# Altium project LimeSDR_1v2s.PrjPcb (part 4 of 4)
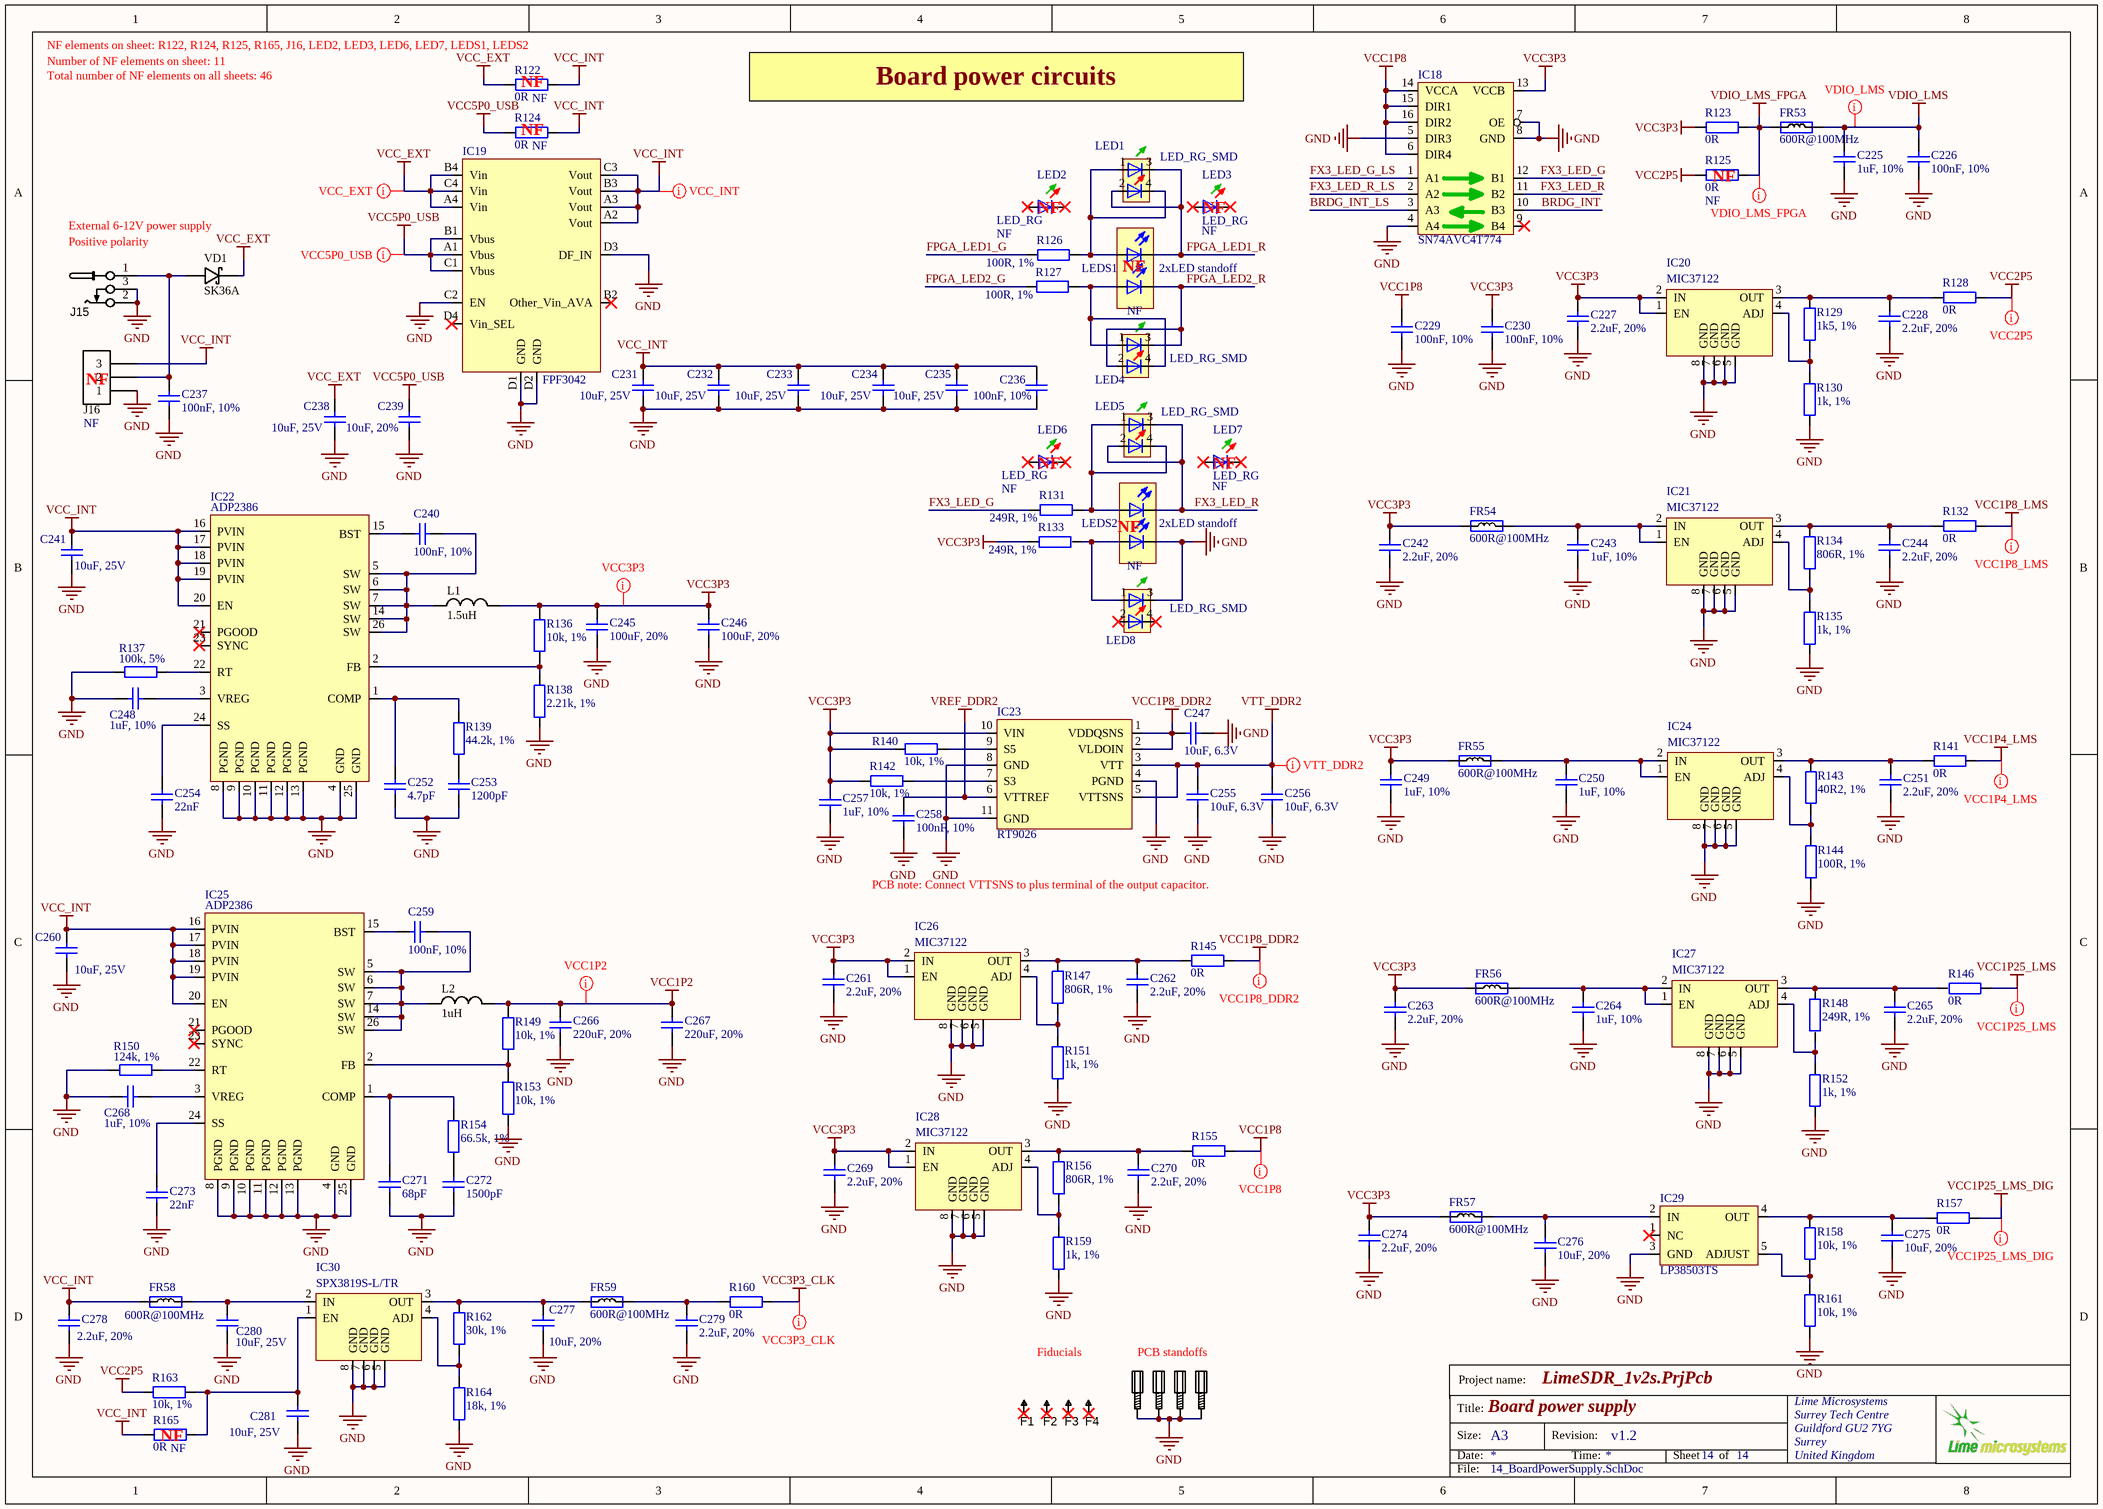
[diagram p10: 14_BoardPowerSupply.SchDoc]

## Nets that join several sheets
GND: 04_LMS7002M_Digital (13 pins), 06_LMS7002M_Power (84 pins), 07_FPGA_banks_1_2_3_4 (15 pins), 08_FPGA_banks_5_6_7_8 (19 pins), 09_FPGA_misc (197 pins), 11_USB3_0_device (44 pins), 14_BoardPowerSupply (132 pins)
VCC1P2: 09_FPGA_misc (62 pins), 14_BoardPowerSupply (C266.2 C267.2 L2.2 R149.1)
VCC1P4_LMS: 06_LMS7002M_Power (6 pins), 14_BoardPowerSupply (R141.1)
VCC1P8: 07_FPGA_banks_1_2_3_4 (R166.2), 09_FPGA_misc (42 pins), 14_BoardPowerSupply (6 pins)
VCC1P8_LMS: 06_LMS7002M_Power (11 pins), 14_BoardPowerSupply (R132.1)
VCC1P25_LMS: 06_LMS7002M_Power (22 pins), 14_BoardPowerSupply (R146.1)
VCC1P25_LMS_DIG: 06_LMS7002M_Power (R16.2 R18.2 R20.2 R22.2), 14_BoardPowerSupply (R157.1)
VCC2P5: 09_FPGA_misc (FR61.1), 14_BoardPowerSupply (R125.2 R128.1 R163.1)
VCC3P3: 09_FPGA_misc (25 pins), 11_USB3_0_device (25 pins), 14_BoardPowerSupply (29 pins)
VCC5P0_USB: 11_USB3_0_device (C132.1 FR36.1 J11.1), 14_BoardPowerSupply (5 pins)
VCC_INT: 09_FPGA_misc (R173.1), 14_BoardPowerSupply (28 pins)
VDIO_LMS: 04_LMS7002M_Digital (14 pins), 06_LMS7002M_Power (5 pins), 14_BoardPowerSupply (C225.2 C226.1 FR53.2)
VDIO_LMS_FPGA: 09_FPGA_misc (33 pins), 11_USB3_0_device (R64.1), 14_BoardPowerSupply (FR53.1 R123.1 R125.1)
VREF_DDR2: 07_FPGA_banks_1_2_3_4 (24 pins), 14_BoardPowerSupply (C258.1 IC23.6)
BRDG_INT: 11_USB3_0_device (IC12.9 R90.1), 14_BoardPowerSupply (IC18.10)
BRDG_INT_LS: 11_USB3_0_device (IC6.F2), 14_BoardPowerSupply (IC18.3)
BRDG_SPI_FPGA_SS: 07_FPGA_banks_1_2_3_4 (IC31.K7), 11_USB3_0_device (IC12.1)
BRDG_SPI_MISO: 07_FPGA_banks_1_2_3_4 (IC31.C1), 09_FPGA_misc (IC32.5), 11_USB3_0_device (IC12.5)
BRDG_SPI_MOSI: 07_FPGA_banks_1_2_3_4 (IC31.B1), 09_FPGA_misc (IC32.2), 11_USB3_0_device (IC12.6)
BRDG_SPI_SCLK: 07_FPGA_banks_1_2_3_4 (IC31.B2), 09_FPGA_misc (IC32.11), 11_USB3_0_device (IC12.11)
EXP_AS_SS: 09_FPGA_misc (IC32.14 R184.2), 11_USB3_0_device (IC10.2)
EXP_AS_SW: 09_FPGA_misc (R181.2), 11_USB3_0_device (IC10.10)
FAN_CTRL: 07_FPGA_banks_1_2_3_4 (IC31.E4), 09_FPGA_misc (R182.2 R185.1 VT1.G)
FPGA_AS_ASDO: 07_FPGA_banks_1_2_3_4 (IC31.D1), 09_FPGA_misc (IC32.3)
FPGA_AS_DATA0: 07_FPGA_banks_1_2_3_4 (IC31.K1), 09_FPGA_misc (R186.2)
FPGA_AS_NCSO: 07_FPGA_banks_1_2_3_4 (IC31.E2), 09_FPGA_misc (IC32.13)
FPGA_CONF_DONE: 09_FPGA_misc (IC31.M18), 11_USB3_0_device (R64.2 R69.2)
FPGA_GPIO0: 07_FPGA_banks_1_2_3_4 (IC31.H8), 09_FPGA_misc (J18.3)
FPGA_GPIO1: 07_FPGA_banks_1_2_3_4 (IC31.H6), 09_FPGA_misc (J18.4)
FPGA_GPIO2: 07_FPGA_banks_1_2_3_4 (IC31.H2), 09_FPGA_misc (J18.5)
FPGA_GPIO3: 07_FPGA_banks_1_2_3_4 (IC31.H1), 09_FPGA_misc (J18.6)
FPGA_GPIO4: 07_FPGA_banks_1_2_3_4 (IC31.G4), 09_FPGA_misc (J18.7)
FPGA_GPIO5: 07_FPGA_banks_1_2_3_4 (IC31.G3), 09_FPGA_misc (J18.8)
FPGA_GPIO6: 07_FPGA_banks_1_2_3_4 (IC31.F2), 09_FPGA_misc (J18.9)
FPGA_GPIO7: 07_FPGA_banks_1_2_3_4 (IC31.F1), 09_FPGA_misc (J18.10)
FPGA_I2C_SCL: 07_FPGA_banks_1_2_3_4 (IC31.H7), 11_USB3_0_device (R72.2)
FPGA_I2C_SDA: 07_FPGA_banks_1_2_3_4 (IC31.J7), 11_USB3_0_device (R70.2)
FPGA_LED1_G: 07_FPGA_banks_1_2_3_4 (IC31.D2), 14_BoardPowerSupply (R126.1)
FPGA_LED1_R: 07_FPGA_banks_1_2_3_4 (IC31.E3), 14_BoardPowerSupply (LED1.2 LED1.3 LEDS1.K1)
FPGA_LED2_G: 07_FPGA_banks_1_2_3_4 (IC31.J4), 14_BoardPowerSupply (R127.1)
FPGA_LED2_R: 07_FPGA_banks_1_2_3_4 (IC31.E1), 14_BoardPowerSupply (LED4.2 LED4.3 LEDS1.K2)
FPGA_NCONFIG: 09_FPGA_misc (IC31.K5), 11_USB3_0_device (R66.2 R67.2)
FPGA_NSTATUS: 09_FPGA_misc (IC31.K6), 11_USB3_0_device (R65.2 R68.2)
FPGA_SPI0_LMS_SS: 04_LMS7002M_Digital (R10.2), 08_FPGA_banks_5_6_7_8 (IC31.D10)
FPGA_SPI0_MISO: 04_LMS7002M_Digital (R13.2), 08_FPGA_banks_5_6_7_8 (IC31.C8)
FPGA_SPI0_MOSI: 04_LMS7002M_Digital (R12.2), 08_FPGA_banks_5_6_7_8 (IC31.D7)
FPGA_SPI0_SCLK: 04_LMS7002M_Digital (R11.2), 08_FPGA_banks_5_6_7_8 (IC31.E6)
FPGA_UART_RX: 07_FPGA_banks_1_2_3_4 (IC31.J1), 11_USB3_0_device (R71.2)
FPGA_UART_TX: 07_FPGA_banks_1_2_3_4 (IC31.J8), 11_USB3_0_device (R73.2)
FX3_CTL0: 07_FPGA_banks_1_2_3_4 (IC31.L6), 11_USB3_0_device (R60.2)
FX3_CTL1: 07_FPGA_banks_1_2_3_4 (IC31.L7), 11_USB3_0_device (R61.2)
FX3_CTL2: 07_FPGA_banks_1_2_3_4 (IC31.M1), 11_USB3_0_device (R61.4)
FX3_CTL3: 07_FPGA_banks_1_2_3_4 (IC31.M2), 11_USB3_0_device (R61.6)
FX3_CTL4: 07_FPGA_banks_1_2_3_4 (IC31.M3), 11_USB3_0_device (R61.8)
FX3_CTL5: 07_FPGA_banks_1_2_3_4 (IC31.M4), 11_USB3_0_device (R62.2)
FX3_CTL6: 07_FPGA_banks_1_2_3_4 (IC31.M6), 11_USB3_0_device (R62.4)
FX3_CTL7: 07_FPGA_banks_1_2_3_4 (IC31.M7), 11_USB3_0_device (R62.6)
FX3_CTL8: 07_FPGA_banks_1_2_3_4 (IC31.M8), 11_USB3_0_device (R62.8)
FX3_CTL9: 07_FPGA_banks_1_2_3_4 (IC31.N1), 11_USB3_0_device (R63.2)
FX3_CTL10: 07_FPGA_banks_1_2_3_4 (IC31.N2), 11_USB3_0_device (R63.4)
FX3_CTL11: 07_FPGA_banks_1_2_3_4 (IC31.N5), 11_USB3_0_device (R63.6)
FX3_CTL12: 07_FPGA_banks_1_2_3_4 (IC31.N6), 11_USB3_0_device (R63.8)
FX3_DQ0: 08_FPGA_banks_5_6_7_8 (IC31.M19), 11_USB3_0_device (R48.2)
FX3_DQ1: 08_FPGA_banks_5_6_7_8 (IC31.AA21), 11_USB3_0_device (R48.4)
FX3_DQ2: 08_FPGA_banks_5_6_7_8 (IC31.Y22), 11_USB3_0_device (R48.6)
FX3_DQ3: 08_FPGA_banks_5_6_7_8 (IC31.Y21), 11_USB3_0_device (R48.8)
FX3_DQ4: 08_FPGA_banks_5_6_7_8 (IC31.W22), 11_USB3_0_device (R50.2)
FX3_DQ5: 08_FPGA_banks_5_6_7_8 (IC31.W21), 11_USB3_0_device (R50.4)
FX3_DQ6: 08_FPGA_banks_5_6_7_8 (IC31.W20), 11_USB3_0_device (R50.6)
FX3_DQ7: 08_FPGA_banks_5_6_7_8 (IC31.V22), 11_USB3_0_device (R50.8)
FX3_DQ8: 08_FPGA_banks_5_6_7_8 (IC31.V21), 11_USB3_0_device (R52.2)
FX3_DQ9: 08_FPGA_banks_5_6_7_8 (IC31.U22), 11_USB3_0_device (R52.4)
FX3_DQ10: 08_FPGA_banks_5_6_7_8 (IC31.U21), 11_USB3_0_device (R52.6)
FX3_DQ11: 08_FPGA_banks_5_6_7_8 (IC31.U20), 11_USB3_0_device (R52.8)
FX3_DQ12: 08_FPGA_banks_5_6_7_8 (IC31.U19), 11_USB3_0_device (R57.2)
FX3_DQ13: 08_FPGA_banks_5_6_7_8 (IC31.M22), 11_USB3_0_device (R57.4)
FX3_DQ14: 08_FPGA_banks_5_6_7_8 (IC31.M21), 11_USB3_0_device (R57.6)
FX3_DQ15: 08_FPGA_banks_5_6_7_8 (IC31.R22), 11_USB3_0_device (R57.8)
FX3_DQ16: 08_FPGA_banks_5_6_7_8 (IC31.R21), 11_USB3_0_device (R49.1)
FX3_DQ17: 08_FPGA_banks_5_6_7_8 (IC31.R20), 11_USB3_0_device (R49.3)
FX3_DQ18: 08_FPGA_banks_5_6_7_8 (IC31.R19), 11_USB3_0_device (R49.5)
FX3_DQ19: 08_FPGA_banks_5_6_7_8 (IC31.R18), 11_USB3_0_device (R49.7)
FX3_DQ20: 08_FPGA_banks_5_6_7_8 (IC31.P22), 11_USB3_0_device (R51.1)
FX3_DQ21: 08_FPGA_banks_5_6_7_8 (IC31.P21), 11_USB3_0_device (R51.3)
FX3_DQ22: 08_FPGA_banks_5_6_7_8 (IC31.M20), 11_USB3_0_device (R51.5)
FX3_DQ23: 08_FPGA_banks_5_6_7_8 (IC31.P16), 11_USB3_0_device (R51.7)
FX3_DQ24: 08_FPGA_banks_5_6_7_8 (IC31.P15), 11_USB3_0_device (R55.1)
FX3_DQ25: 08_FPGA_banks_5_6_7_8 (IC31.N22), 11_USB3_0_device (R55.3)
FX3_DQ26: 08_FPGA_banks_5_6_7_8 (IC31.N21), 11_USB3_0_device (R55.5)
FX3_DQ27: 08_FPGA_banks_5_6_7_8 (IC31.N20), 11_USB3_0_device (R55.7)
FX3_DQ28: 08_FPGA_banks_5_6_7_8 (IC31.N19), 11_USB3_0_device (R58.1)
FX3_DQ29: 08_FPGA_banks_5_6_7_8 (IC31.N18), 11_USB3_0_device (R58.3)
FX3_DQ30: 08_FPGA_banks_5_6_7_8 (IC31.N17), 11_USB3_0_device (R58.5)
FX3_DQ31: 08_FPGA_banks_5_6_7_8 (IC31.N16), 11_USB3_0_device (R58.7)
FX3_LED_G_LS: 11_USB3_0_device (IC6.H6), 14_BoardPowerSupply (IC18.1)
FX3_LED_R_LS: 11_USB3_0_device (IC6.K5), 14_BoardPowerSupply (IC18.2)
FX3_PCLK: 08_FPGA_banks_5_6_7_8 (IC31.T18), 11_USB3_0_device (R59.1)
LM75_OS: 07_FPGA_banks_1_2_3_4 (IC31.J6), 09_FPGA_misc (R182.1), 11_USB3_0_device (IC9.3 R92.1)
LMS_CORE_LDO_EN: 04_LMS7002M_Digital (IC1.U33 R8.1), 08_FPGA_banks_5_6_7_8 (IC31.B18)
LMS_DIQ1_D0: 04_LMS7002M_Digital (IC1.AG31), 08_FPGA_banks_5_6_7_8 (IC31.B17)
LMS_DIQ1_D1: 04_LMS7002M_Digital (IC1.AF30), 08_FPGA_banks_5_6_7_8 (IC31.B16)
LMS_DIQ1_D2: 04_LMS7002M_Digital (IC1.AF34), 08_FPGA_banks_5_6_7_8 (IC31.B15)
LMS_DIQ1_D3: 04_LMS7002M_Digital (IC1.AE31), 08_FPGA_banks_5_6_7_8 (IC31.B14)
LMS_DIQ1_D4: 04_LMS7002M_Digital (IC1.AD30), 08_FPGA_banks_5_6_7_8 (IC31.B13)
LMS_DIQ1_D5: 04_LMS7002M_Digital (IC1.AC29), 08_FPGA_banks_5_6_7_8 (IC31.C13)
LMS_DIQ1_D6: 04_LMS7002M_Digital (IC1.AE33), 08_FPGA_banks_5_6_7_8 (IC31.A18)
LMS_DIQ1_D7: 04_LMS7002M_Digital (IC1.AD32), 08_FPGA_banks_5_6_7_8 (IC31.A17)
LMS_DIQ1_D8: 04_LMS7002M_Digital (IC1.AC31), 08_FPGA_banks_5_6_7_8 (IC31.A16)
LMS_DIQ1_D9: 04_LMS7002M_Digital (IC1.AC33), 08_FPGA_banks_5_6_7_8 (IC31.A15)
LMS_DIQ1_D10: 04_LMS7002M_Digital (IC1.AB30), 08_FPGA_banks_5_6_7_8 (IC31.A14)
LMS_DIQ1_D11: 04_LMS7002M_Digital (IC1.AB32), 08_FPGA_banks_5_6_7_8 (IC31.A13)
LMS_DIQ2_D0: 04_LMS7002M_Digital (IC1.H30), 08_FPGA_banks_5_6_7_8 (IC31.B7)
LMS_DIQ2_D1: 04_LMS7002M_Digital (IC1.J31), 08_FPGA_banks_5_6_7_8 (IC31.B6)
LMS_DIQ2_D2: 04_LMS7002M_Digital (IC1.K30), 08_FPGA_banks_5_6_7_8 (IC31.B4)
LMS_DIQ2_D3: 04_LMS7002M_Digital (IC1.K32), 08_FPGA_banks_5_6_7_8 (IC31.B3)
LMS_DIQ2_D4: 04_LMS7002M_Digital (IC1.L31), 08_FPGA_banks_5_6_7_8 (IC31.A10)
LMS_DIQ2_D5: 04_LMS7002M_Digital (IC1.K34), 08_FPGA_banks_5_6_7_8 (IC31.A9)
LMS_DIQ2_D6: 04_LMS7002M_Digital (IC1.M30), 08_FPGA_banks_5_6_7_8 (IC31.A8)
LMS_DIQ2_D7: 04_LMS7002M_Digital (IC1.M32), 08_FPGA_banks_5_6_7_8 (IC31.A7)
LMS_DIQ2_D8: 04_LMS7002M_Digital (IC1.N31), 08_FPGA_banks_5_6_7_8 (IC31.A6)
LMS_DIQ2_D9: 04_LMS7002M_Digital (IC1.N33), 08_FPGA_banks_5_6_7_8 (IC31.A5)
LMS_DIQ2_D10: 04_LMS7002M_Digital (IC1.P30), 08_FPGA_banks_5_6_7_8 (IC31.A4)
LMS_DIQ2_D11: 04_LMS7002M_Digital (IC1.P32), 08_FPGA_banks_5_6_7_8 (IC31.A3)
LMS_ENABLE_IQSEL1: 04_LMS7002M_Digital (IC1.Y32), 08_FPGA_banks_5_6_7_8 (IC31.C4)
LMS_ENABLE_IQSEL2: 04_LMS7002M_Digital (IC1.R33), 08_FPGA_banks_5_6_7_8 (IC31.C7)
LMS_FCLK1: 04_LMS7002M_Digital (IC1.AA33), 08_FPGA_banks_5_6_7_8 (IC31.B20)
LMS_FCLK2: 04_LMS7002M_Digital (IC1.R29), 08_FPGA_banks_5_6_7_8 (IC31.E5)
LMS_MCLK1: 04_LMS7002M_Digital (IC1.AB34), 09_FPGA_misc (IC31.G21)
LMS_MCLK2: 04_LMS7002M_Digital (IC1.P34), 09_FPGA_misc (IC31.B11)
LMS_RESET: 04_LMS7002M_Digital (IC1.E27 R7.1), 08_FPGA_banks_5_6_7_8 (IC31.C6)
LMS_RXEN: 04_LMS7002M_Digital (IC1.V34 R3.2), 08_FPGA_banks_5_6_7_8 (IC31.C3)
LMS_TXEN: 04_LMS7002M_Digital (IC1.U29 R6.2), 08_FPGA_banks_5_6_7_8 (IC31.B10)
LMS_TXNRX1: 04_LMS7002M_Digital (IC1.V32 R5.2), 08_FPGA_banks_5_6_7_8 (IC31.B9)
LMS_TXNRX2: 04_LMS7002M_Digital (IC1.U31 R2.2), 08_FPGA_banks_5_6_7_8 (IC31.B8)